# EAGLE design triacs_board_4 (EAGLE 5.04)
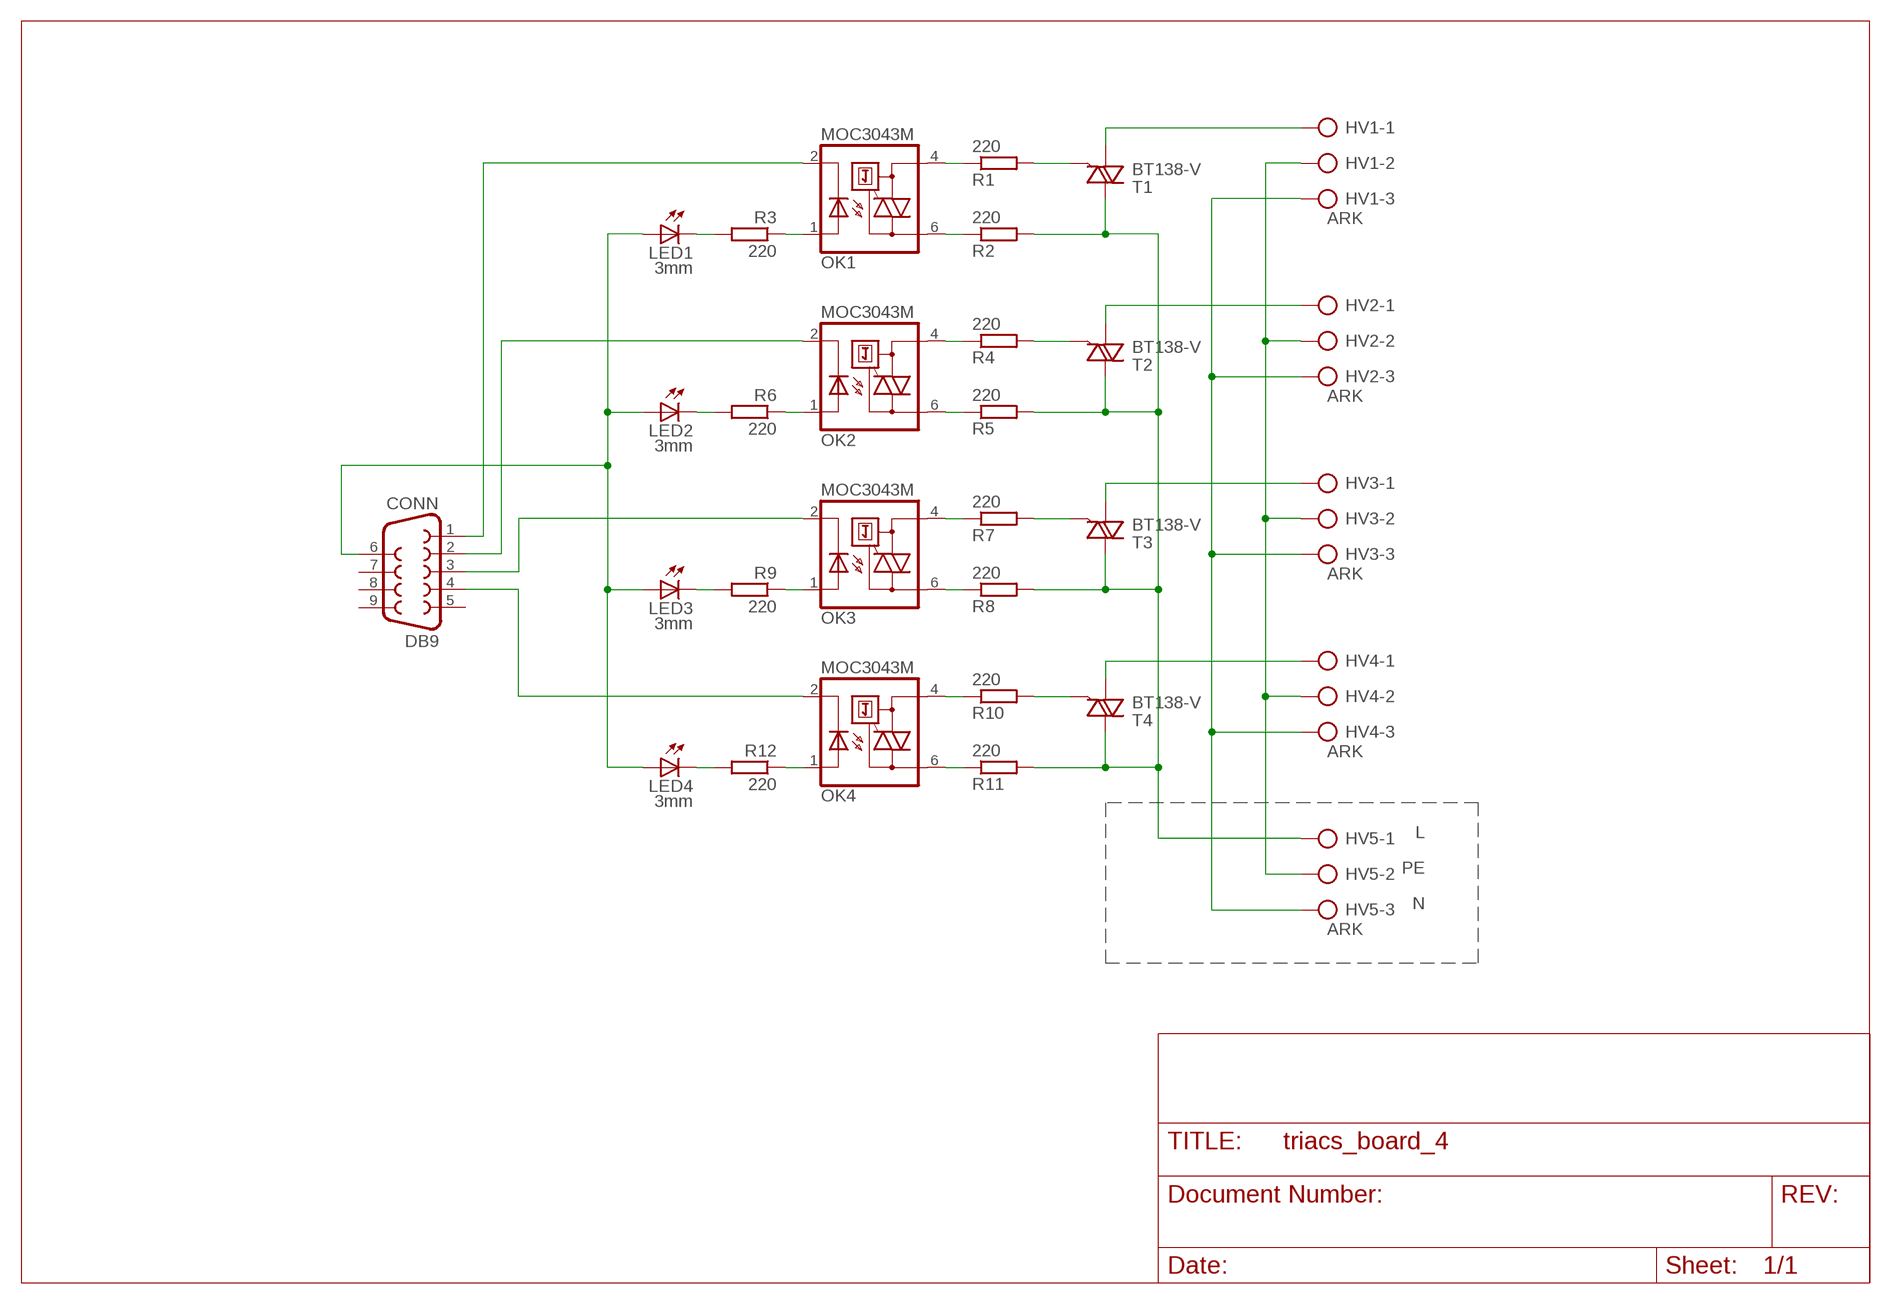
[diagram p0: schematic, sheet 1]

## Parts
CONN  DB9  F09H  [F09H]
HV1  ARK  AK500/3  [AK500/3]
HV2  ARK  AK500/3  [AK500/3]
HV3  ARK  AK500/3  [AK500/3]
HV4  ARK  AK500/3  [AK500/3]
HV5  ARK  AK500/3  [AK500/3]
LED1  3mm  LED3MM  [LED3MM]
LED2  3mm  LED3MM  [LED3MM]
LED3  3mm  LED3MM  [LED3MM]
LED4  3mm  LED3MM  [LED3MM]
OK1  MOC3043M  [DIL06]
OK2  MOC3043M  [DIL06]
OK3  MOC3043M  [DIL06]
OK4  MOC3043M  [DIL06]
R1  220  R-EU_0207/2V  [0207/2V]
R2  220  R-EU_0207/2V  [0207/2V]
R3  220  R-EU_0207/2V  [0207/2V]
R4  220  R-EU_0207/2V  [0207/2V]
R5  220  R-EU_0207/2V  [0207/2V]
R6  220  R-EU_0207/2V  [0207/2V]
R7  220  R-EU_0207/2V  [0207/2V]
R8  220  R-EU_0207/2V  [0207/2V]
R9  220  R-EU_0207/2V  [0207/2V]
R10  220  R-EU_0207/2V  [0207/2V]
R11  220  R-EU_0207/2V  [0207/2V]
R12  220  R-EU_0207/2V  [0207/2V]
T1  BT138-V  [TO220BV]
T2  BT138-V  [TO220BV]
T3  BT138-V  [TO220BV]
T4  BT138-V  [TO220BV]

## Nets
N$1: HV1.3 HV2.3 HV3.3 HV4.3 HV5.3
N$2: HV1.1 T1.T1(A1)
N$3: R1.2 T1.G
N$4: OK1.4(A1) R1.1
N$5: OK1.6(A2) R2.1
N$6: OK1.1(A) R3.1
N$7: LED1.K(C) R3.2
N$8: CONN.1 OK1.2(C)
N$9: HV1.2 HV2.2 HV3.2 HV4.2 HV5.2
N$10: HV2.1 T2.T1(A1)
N$11: R4.2 T2.G
N$12: OK2.4(A1) R4.1
N$13: OK2.6(A2) R5.1
N$14: OK2.1(A) R6.1
N$15: LED2.K(C) R6.2
N$16: CONN.2 OK2.2(C)
N$18: HV3.1 T3.T1(A1)
N$19: R7.2 T3.G
N$20: OK3.4(A1) R7.1
N$21: OK3.6(A2) R8.1
N$22: OK3.1(A) R9.1
N$23: LED3.K(C) R9.2
N$24: CONN.3 OK3.2(C)
N$25: HV5.1 R2.2 R5.2 R8.2 R11.2 T1.T2(A2) T2.T2(A2) T3.T2(A2) T4.T2(A2)
N$27: R10.2 T4.G
N$28: OK4.4(A1) R10.1
N$29: OK4.6(A2) R11.1
N$30: OK4.1(A) R12.1
N$31: LED4.K(C) R12.2
N$32: CONN.4 OK4.2(C)
N$33: HV4.1 T4.T1(A1)
N$34: CONN.6 LED1.A LED2.A LED3.A LED4.A
Unconnected: CONN.5 CONN.7 CONN.8 CONN.9

## Notes on the sheet
- L
- PE
- N

## Library data of the parts
CONN = con-subd:F09: SUB-D
HV1-HV5 = con-ptr500:AK500/3: CONNECTOR
LED1-LED4 = led:LED: LED OSRAM: - CHIPLED LG R971, LG N971, LY N971, LG Q971, LY Q971, LO R971, LY R971 LH N974, LH R974 LS Q976, LO Q976, LY Q976 LO Q996 - Hyper CHIPLED LW Q18S LB Q993, LB Q99A, LB R99A - SideLED LS A670, LO A670, LY A670, LG A670, LP A670 LB A673, LV A673, LT A673, LW A673 LH A674 LY A675 LS A676, LA A676, LO A676, LY A676, LW A676 LS A679, LY A679, LG A679 - Hyper Micro SIDELED® LS Y876, LA Y876, LO Y876, LY Y876 LT Y87S - SmartLED LW L88C, LW L88S LB L89C, LB L89S, LG L890 LS L89K, LO L89K, LY L89K LS L896, LA L896, LO L896, LY L896 - TOPLED LS T670, LO T670, LY T670, LG T670, LP T670 LSG T670, LSP T670, LSY T670, LOP T670, LYG T670 LG T671, LOG T671, LSG T671 LB T673, LV T673, LT T673, LW T673 LH T674 LS T676, LA T676, LO T676, LY T676, LB T676, LH T676, LSB T676, LW T676 LB T67C, LV T67C, LT T67C, LS T67K, LO T67K, LY T67K, LW E67C LS E67B, LA E67B, LO E67B, LY E67B, LB E67C, LV E67C, LT E67C LW T67C LS T679, LY T679, LG T679 LS T770, LO T770, LY T770, LG T770, LP T770 LB T773, LV T773, LT T773, LW T773 LH T774 LS E675, LA E675, LY E675, LS T675 LS T776, LA T776, LO T776, LY T776, LB T776 LHGB T686 LT T68C, LB T68C - Hyper Mini TOPLED® LB M676 - Mini TOPLED Santana® LG M470 LS M47K, LO M47K, LY M47K Source: http://www.osram.convergy.de LUXEON: - LUMILED® LXK2-PW12-R00, LXK2-PW12-S00, LXK2-PW14-U00, LXK2-PW14-V00 LXK2-PM12-R00, LXK2-PM12-S00, LXK2-PM14-U00 LXK2-PE12-Q00, LXK2-PE12-R00, LXK2-PE12-S00, LXK2-PE14-T00, LXK2-PE14-U00 LXK2-PB12-K00, LXK2-PB12-L00, LXK2-PB12-M00, LXK2-PB14-N00, LXK2-PB14-P00, LXK2-PB14-Q00 LXK2-PR12-L00, LXK2-PR12-M00, LXK2-PR14-Q00, LXK2-PR14-R00 LXK2-PD12-Q00, LXK2-PD12-R00, LXK2-PD12-S00 LXK2-PH12-R00, LXK2-PH12-S00 LXK2-PL12-P00, LXK2-PL12-Q00, LXK2-PL12-R00 Source: www.luxeon.com KINGBRIGHT: KA-3528ASYC Source: www.kingbright.com
OK1-OK4 = optocoupler:MOC30*: 6-Pin DIP Zero-Cross Optoisolators Triac Driver Output (250/400 Volt Peak) Source: http://www.fairchildsemi.com/ds/MO/MOC3043-M.pdf
R1-R12 = rcl:R-EU_: RESISTOR, European symbol
T1-T4 = triac:BT138: TRIAC Source: http://www.semiconductors.philips.com BT138_SERIES_2.pdf

## Board
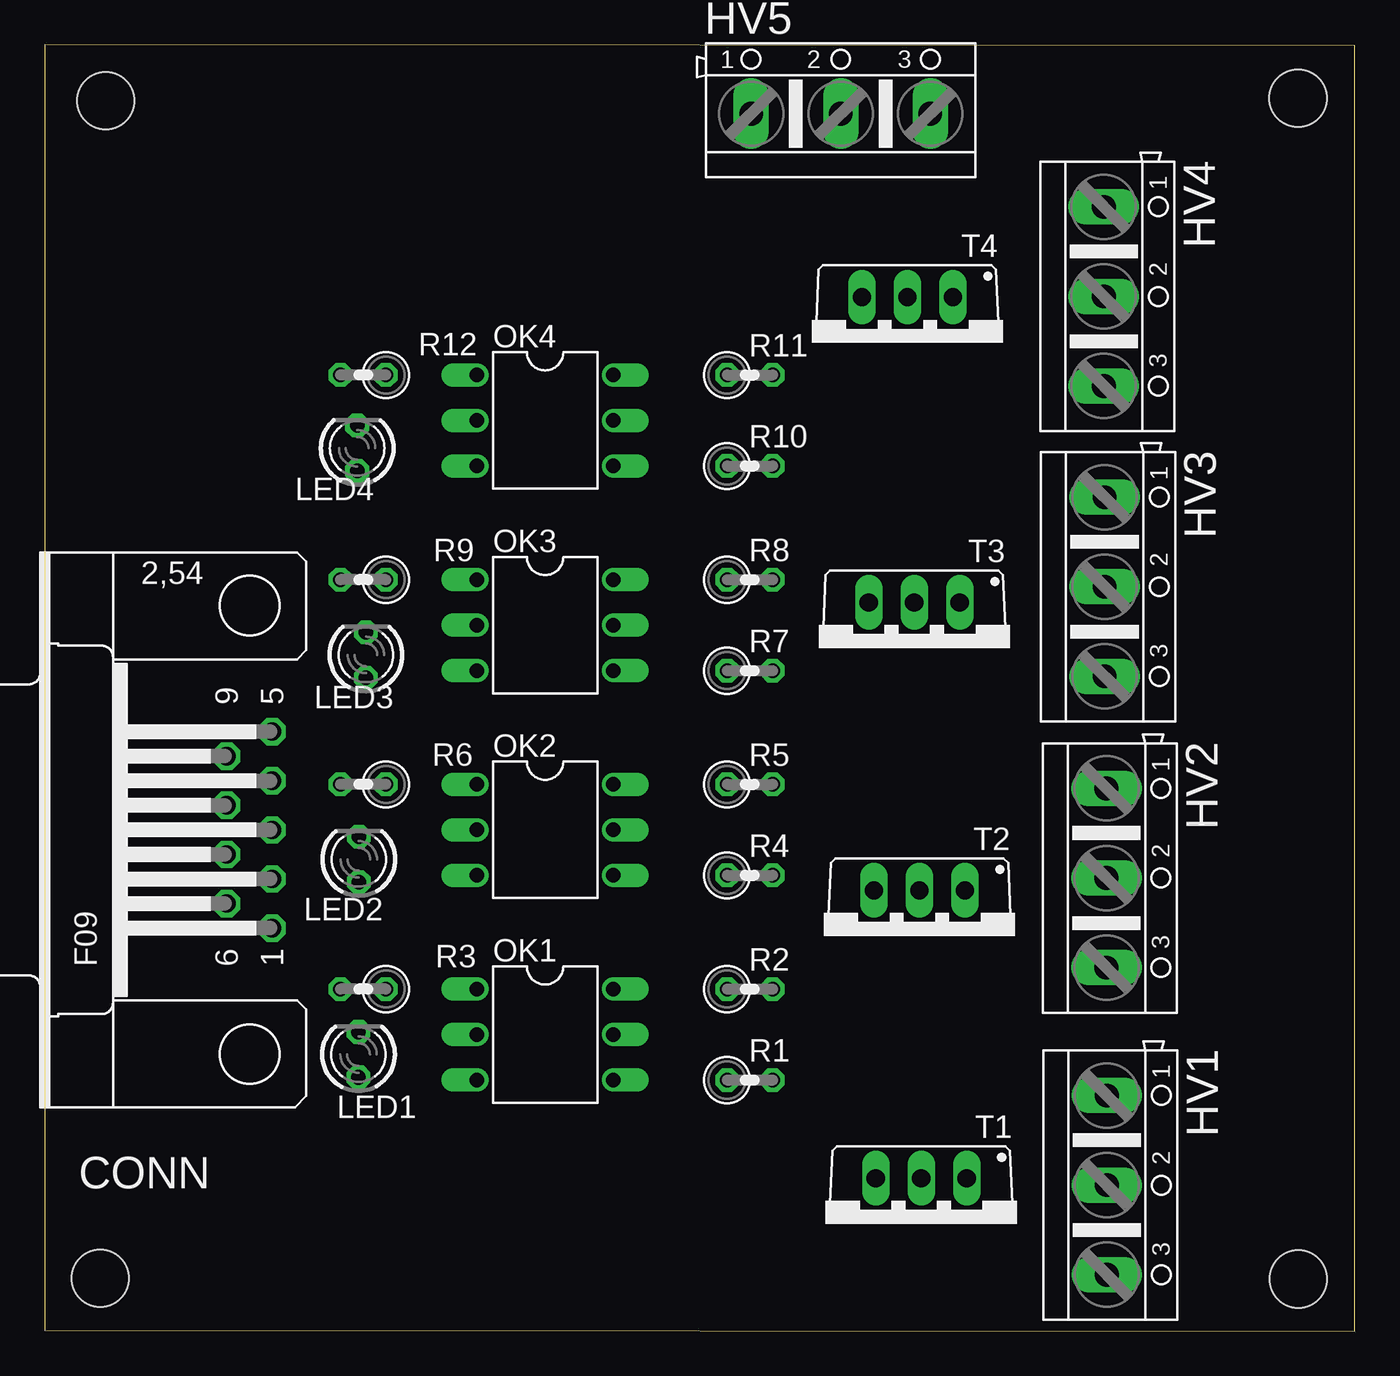
[diagram p1: board, top side]
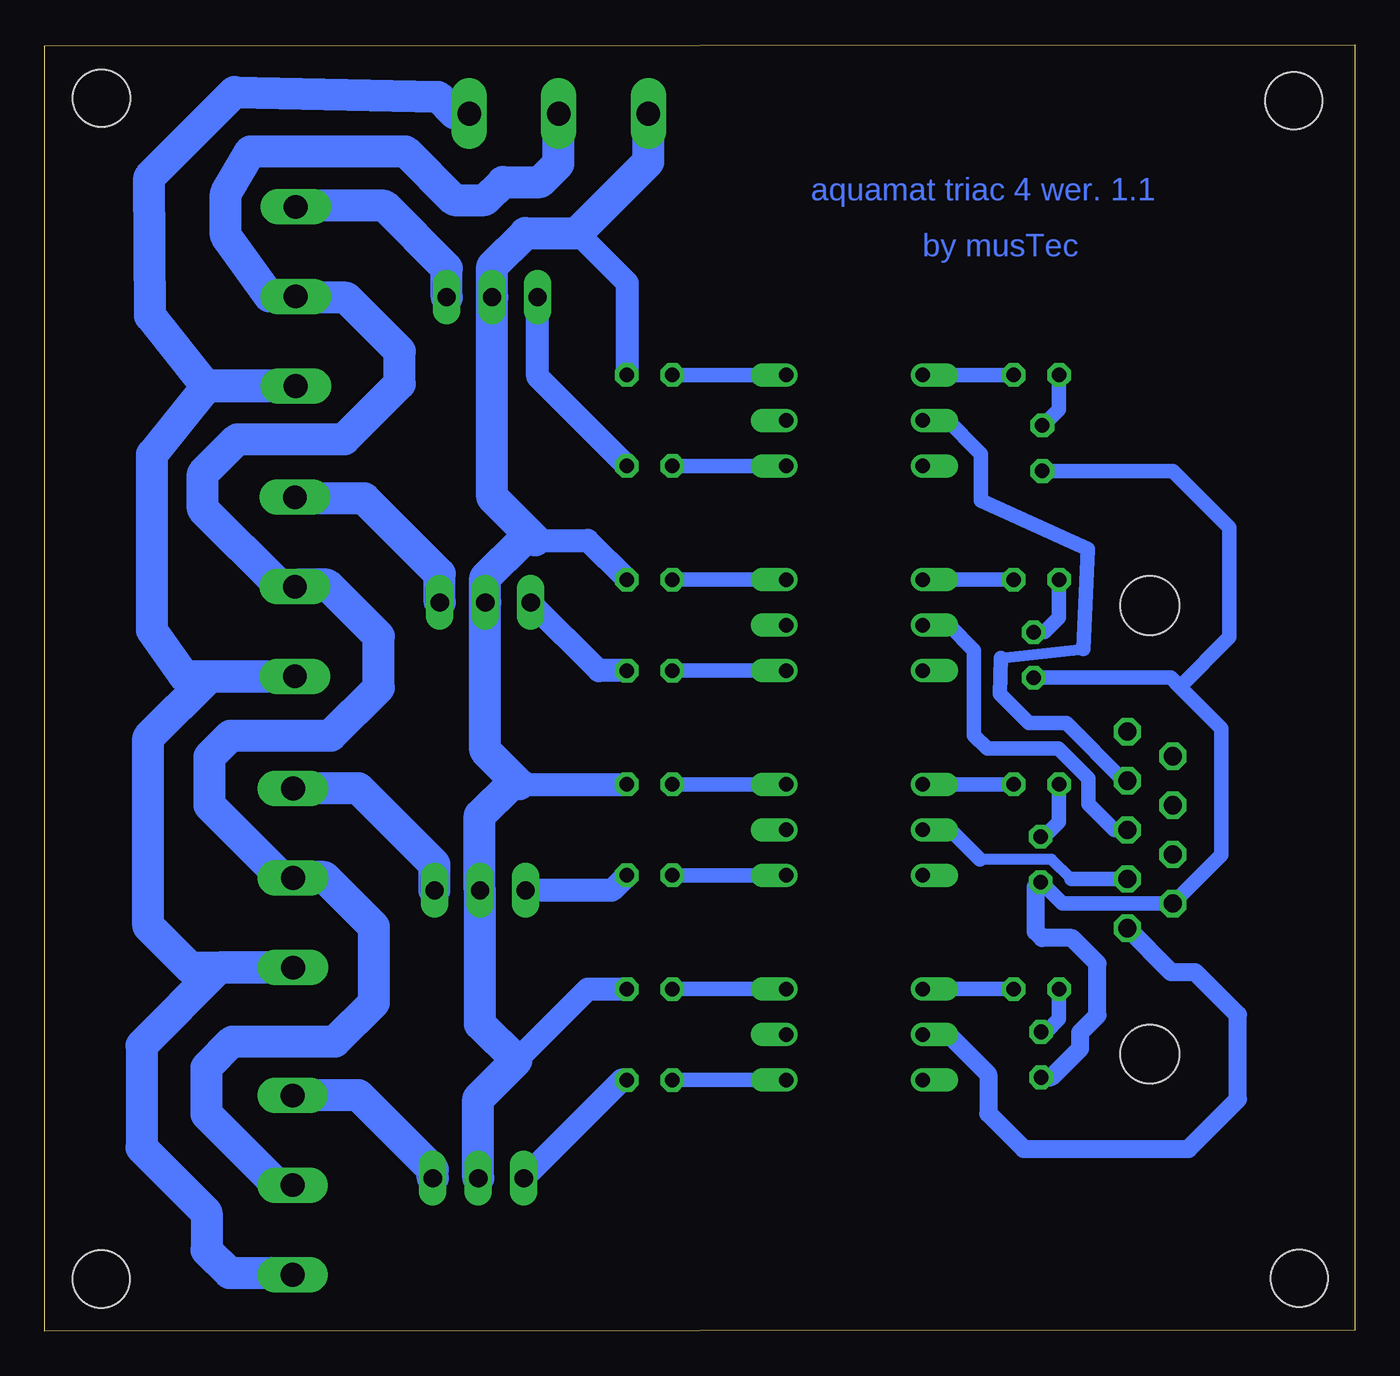
[diagram p2: board, bottom side, seen from below]

Size 73.15 x 71.83 mm. Coordinates in mm from the lower left corner, seen from the top.
Outline: 0,0.05 73.15,0 73.15,71.78 0,71.83 0,0.05
Copper layers (1*16): Top 0.035mm / dielectric 1.5mm / Bottom 0.035mm
Design rules "default": minimum track width 10mil, minimum drill 24mil, track to track 8mil, track to pad 8mil, pad to pad 8mil, via to via 8mil, smd to smd 8mil, copper to edge 40mil, drill to drill 8mil, minimum pad ring 10mil, minimum via ring 8mil, stop-mask expansion 4mil, vias tented up to drill 0mil, thermal gap 10mil
Holes 3.2 mm at 69.98,68.84 3.4,68.71 3.09,2.95 70,2.91

### Footprints (pad centres in the part's own frame; a part is rotated, then mirrored left to right if it is on the bottom)
F09H = drill 1.016 octagon: 1 -5.486,-1.27; 2 -2.743,-1.27; 3 0,-1.27; 4 2.743,-1.27; 5 5.486,-1.27; 6 -4.115,1.27; 7 -1.372,1.27; 8 1.372,1.27; 9 4.115,1.27 | hole 3.302: -12.522,0; 12.522,0
AK500/3 = drill 1.321 long: 1 -5.004,0; 2 0,0; 3 5.004,0
LED3MM = drill 0.813 octagon: A -1.27,0; K 1.27,0
DIL06 = drill 0.813 offset: 1 -2.54,-3.81; 2 0,-3.81; 3 2.54,-3.81; 4 2.54,3.81; 5 0,3.81; 6 -2.54,3.81
0207/2V = drill 0.813 octagon: 1 -1.27,0; 2 1.27,0
TO220BV = drill 1.016 long: G 2.54,-2.54; T1 -2.54,-2.54; T2 0,-2.54

### Placement (x,y rotation side)
CONN  11.43,27.99 90 top
HV1  59.31,8.15 270 top
HV2  59.28,25.3 270 top
HV3  59.18,41.57 270 top
HV4  59.14,57.78 270 top
HV5  44.44,67.98 0 top
LED1  17.52,15.44 90 top
LED2  17.54,26.35 90 top
LED3  17.93,37.76 90 top
LED4  17.44,49.3 90 top
OK1  27.94,16.56 270 top
OK2  27.94,27.99 270 top
OK3  27.94,39.42 270 top
OK4  27.94,50.85 270 top
R1  39.37,14.02 0 top
R2  39.37,19.1 0 top
R3  17.78,19.1 180 top
R4  39.37,25.45 0 top
R5  39.37,30.53 0 top
R6  17.78,30.53 180 top
R7  39.37,36.88 0 top
R8  39.37,41.96 0 top
R9  17.78,41.96 180 top
R10  39.37,48.31 0 top
R11  39.37,53.39 0 top
R12  17.78,53.39 180 top
T1  48.94,6 180 top
T2  48.84,22.08 180 top
T3  48.55,38.15 180 top
T4  48.16,55.2 180 top

### Tracks (layer width: path | path; a pad name or v marks a point on that pad's centre or on a via)
N$1
  Bottom 1.778: HV5.3 50.25,67.98 51.19,68.92 62.56,69.19 67.31,64.44 67.26,56.69 64.16,52.8 59.16,52.8 HV4.3 64.08,52.77 67.15,48.95 67.15,39.13 65.34,36.56 HV3.3 63.95,36.56 67.37,33.15 67.37,22.63 65.02,20.28 59.3,20.28 HV2.3 63.4,20.3 67.74,15.95 67.74,10.24 64.11,6.61 64.11,4.53 62.83,3.25 59.4,3.25 HV1.3
N$2
  Bottom 1.778: T1.T1 51.48,9.03 55.62,13.18 59.29,13.18 HV1.1
N$3
  Bottom 1.27: R1.2 40.91,14.02 T1.G
N$4
  Bottom 0.813: OK1.4 R1.1
N$5
  Bottom 0.813: OK1.6 R2.1
N$6
  Bottom 0.813: R3.1 OK1.1
N$7
  Bottom 0.61: LED1.K 17.23,16.71 | R3.2
  Bottom 0.813: 17.23,16.71 16.52,17.42 R3.2
N$8
  Bottom 1.016: OK1.2 22.68,16.56 20.46,14.34 20.46,12.15 18.48,10.18 9.29,10.18 7.49,11.98 6.52,12.94 6.52,17.66 8.9,20.05 10.24,20.05 CONN.1
N$9
  Bottom 1.778: HV1.2 60.16,8.15 64.11,12.11 64.11,14.73 62.67,16.17 56.96,16.17 54.77,18.36 54.77,22.58 57.55,25.35 59.23,25.35 HV2.2 59.9,25.3 63.95,29.36 63.95,32.08 62.78,33.25 57.17,33.25 54.5,35.92 54.5,38.81 57.38,41.69 59.06,41.69 HV3.2 59.98,41.57 64.32,45.91 64.32,47.88 62.4,49.81 56.42,49.81 53.33,52.9 53.33,54.72 56.32,57.71 59.07,57.71 HV4.2 60.6,57.78 63.04,61.18 63.04,63.53 61.66,65.88 53.01,65.88 50.28,63.15 48.58,63.15 47.56,64.17 45.48,64.17 44.47,65.18 44.47,67.96 HV5.2
N$10
  Bottom 1.778: T2.T1 51.38,26.07 55.62,30.32 59.27,30.32 HV2.1
N$11
  Bottom 1.27: R4.2 41.48,24.62 T2.G
N$12
  Bottom 0.813: OK2.4 R4.1
N$13
  Bottom 0.813: OK2.6 R5.1
N$14
  Bottom 0.813: R6.1 OK2.1
N$15
  Bottom 0.61: LED2.K 17.34,27.62 | R6.2
  Bottom 0.813: 17.34,27.62 16.52,28.44 R6.2
N$16
  Bottom 0.61: 15.83,25.25 16.93,26.35 20.93,26.35 | 24.11,27.97 OK2.2
  Bottom 0.813: CONN.2 15.83,25.25 | 20.93,26.35 22.55,27.97 24.11,27.97
N$18
  Bottom 1.778: T3.T1 51.09,42.28 55.3,46.5 59.11,46.5 HV3.1
N$19
  Bottom 1.27: R7.2 42.2,36.88 T3.G
N$20
  Bottom 0.813: OK3.4 R7.1
N$21
  Bottom 0.813: OK3.6 R8.1
N$22
  Bottom 0.813: R9.1 OK3.1
N$23
  Bottom 0.61: R9.2
  Bottom 0.813: LED3.K 17.33,39.03 16.52,39.84 R9.2
N$24
  Bottom 0.61: CONN.3 13.42,27.99 | OK3.2
  Bottom 0.813: 13.42,27.99 14.87,29.44 14.87,30.85 16.55,32.53 20.52,32.53 21.26,33.27 21.26,38.01 22.67,39.42 OK3.2
N$25
  Bottom 0.813: 46.48,44.15 45.75,44.15 | 47.12,30.53 46.65,30.53 | T2.T2 48.85,24.63 | 43.41,61.32 42.93,60.84 | 40.63,53.4 R11.2
  Bottom 1.27: R8.2 42.83,44.15 45.75,44.15 | 46.65,30.53 R5.2 | R2.2 42.82,19.1 46.81,15.11 | T1.T2 | 42.93,60.84 40.63,58.53 40.63,53.4
  Bottom 1.778: 46.48,44.15 48.55,42.08 T3.T2 48.55,32.43 46.65,30.53 | 47.12,30.53 48.85,28.8 48.85,24.63 | T1.T2 48.95,12.97 46.81,15.11 48.84,17.13 T2.T2 | 45.75,44.15 48.16,46.56 T4.T2 48.16,59.46 46.31,61.32 43.41,61.32 39.44,65.29 HV5.1
N$27
  Bottom 1.27: R10.2 45.62,53.29 T4.G
N$28
  Bottom 0.813: OK4.4 R10.1
N$29
  Bottom 0.813: OK4.6 R11.1
N$30
  Bottom 0.813: R12.1 OK4.1
N$31
  Bottom 0.61: LED4.K 17.42,50.57 | R12.2
  Bottom 0.813: 17.42,50.57 16.52,51.47 R12.2
N$32
  Bottom 0.61: CONN.4 12.89,30.73 | 19.76,37.57 15.16,38.08 | 24.01,50.97 OK4.2
  Bottom 0.813: 12.89,30.73 16.11,33.95 18.2,33.95 19.82,35.57 19.76,37.57 | 15.16,38.08 14.9,43.67 20.87,46.39 20.87,48.99 22.86,50.97 24.01,50.97
N$33
  Bottom 1.778: T4.T1 50.7,59.36 54.18,62.83 59.08,62.83 HV4.1
N$34
  Bottom 0.813: LED2.A 16.34,23.88 CONN.6 7.46,26.58 7.46,33.67 9.77,35.98 | LED3.A 10.28,36.49 9.77,35.98 | LED4.A 10.16,48.03 7,44.87 7,38.75 9.77,35.98
  Bottom 1.016: LED1.A 16.94,14.17 15.33,15.78 15.33,16.68 14.37,17.64 14.37,20.53 15.79,21.95 17.45,21.95 17.81,22.31 17.81,24.8 LED2.A

### Text on the board
Bottom: aquamat triac 4 wer. 1.1 | by musTec